# EasyEDA schematic SCH_FMPAC-5V-NEW_2023-12-27.json

## Sheets
1 OPLL-5V: TITLE: Sheet_1; REV: 1.0; Date: 2023-12-27; Sheet: 1/1; Drawn By: Denjhang; Company: Your Company
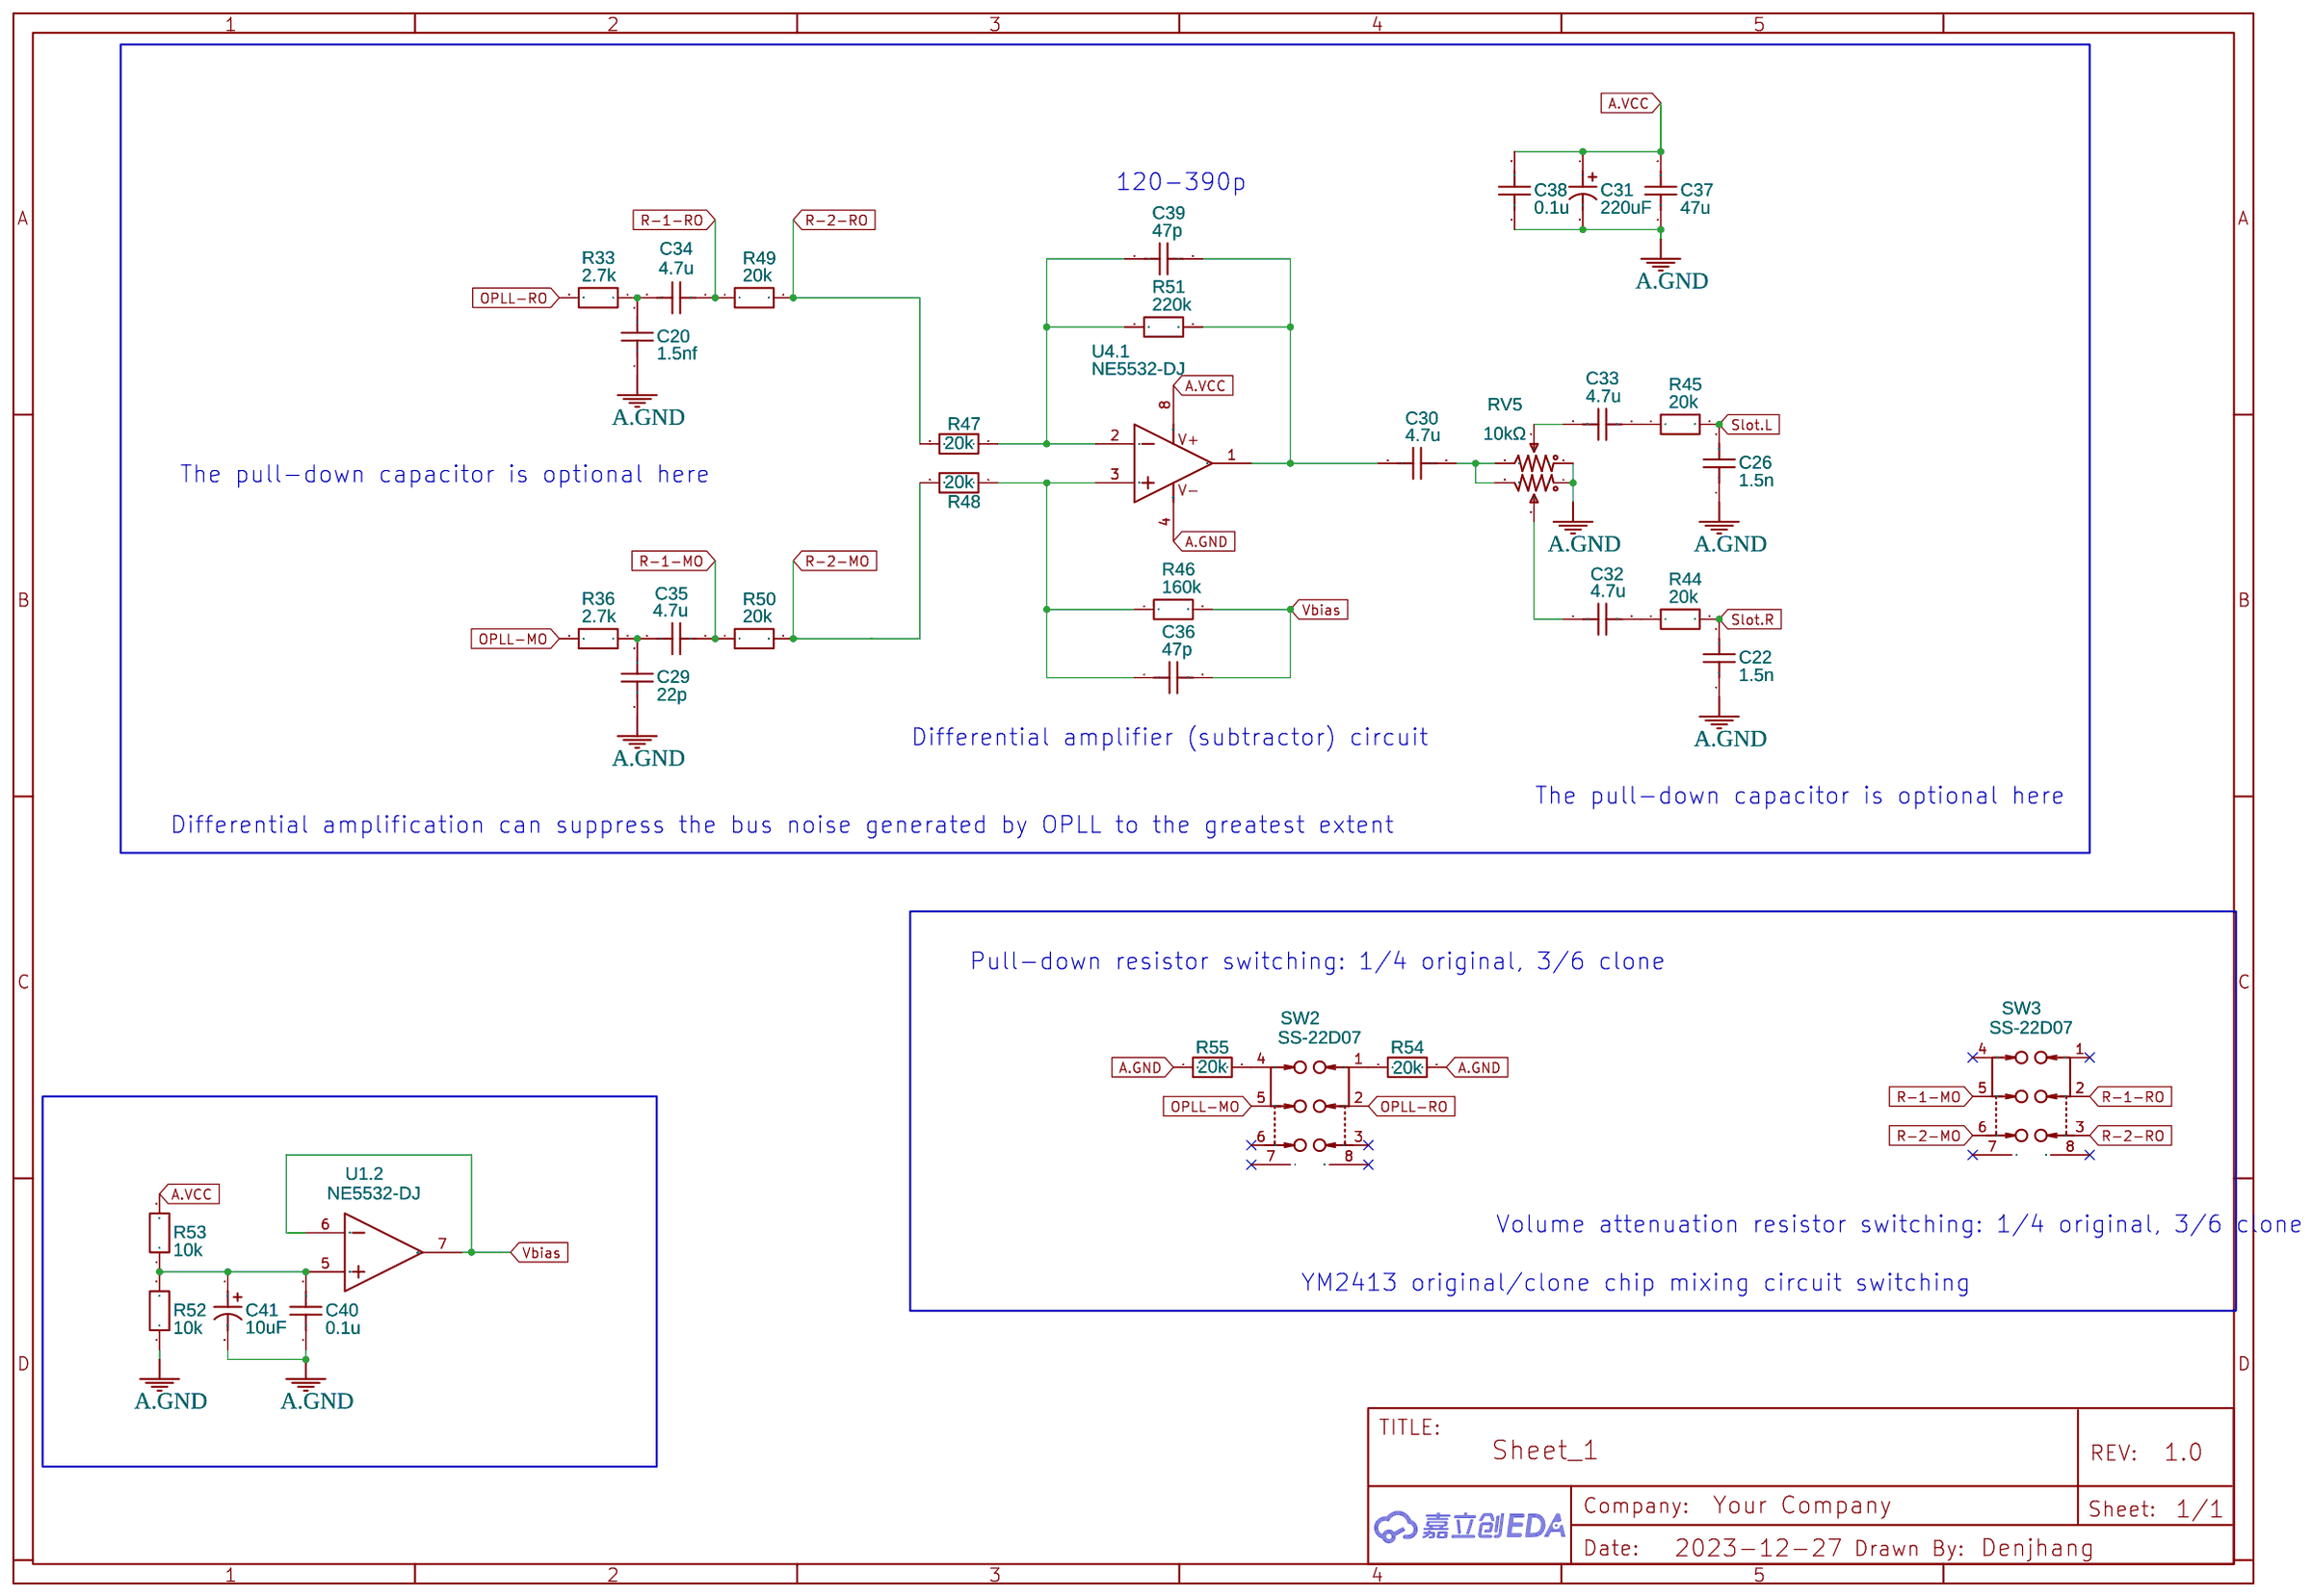
[diagram p0: OPLL-5V]
2 PSG
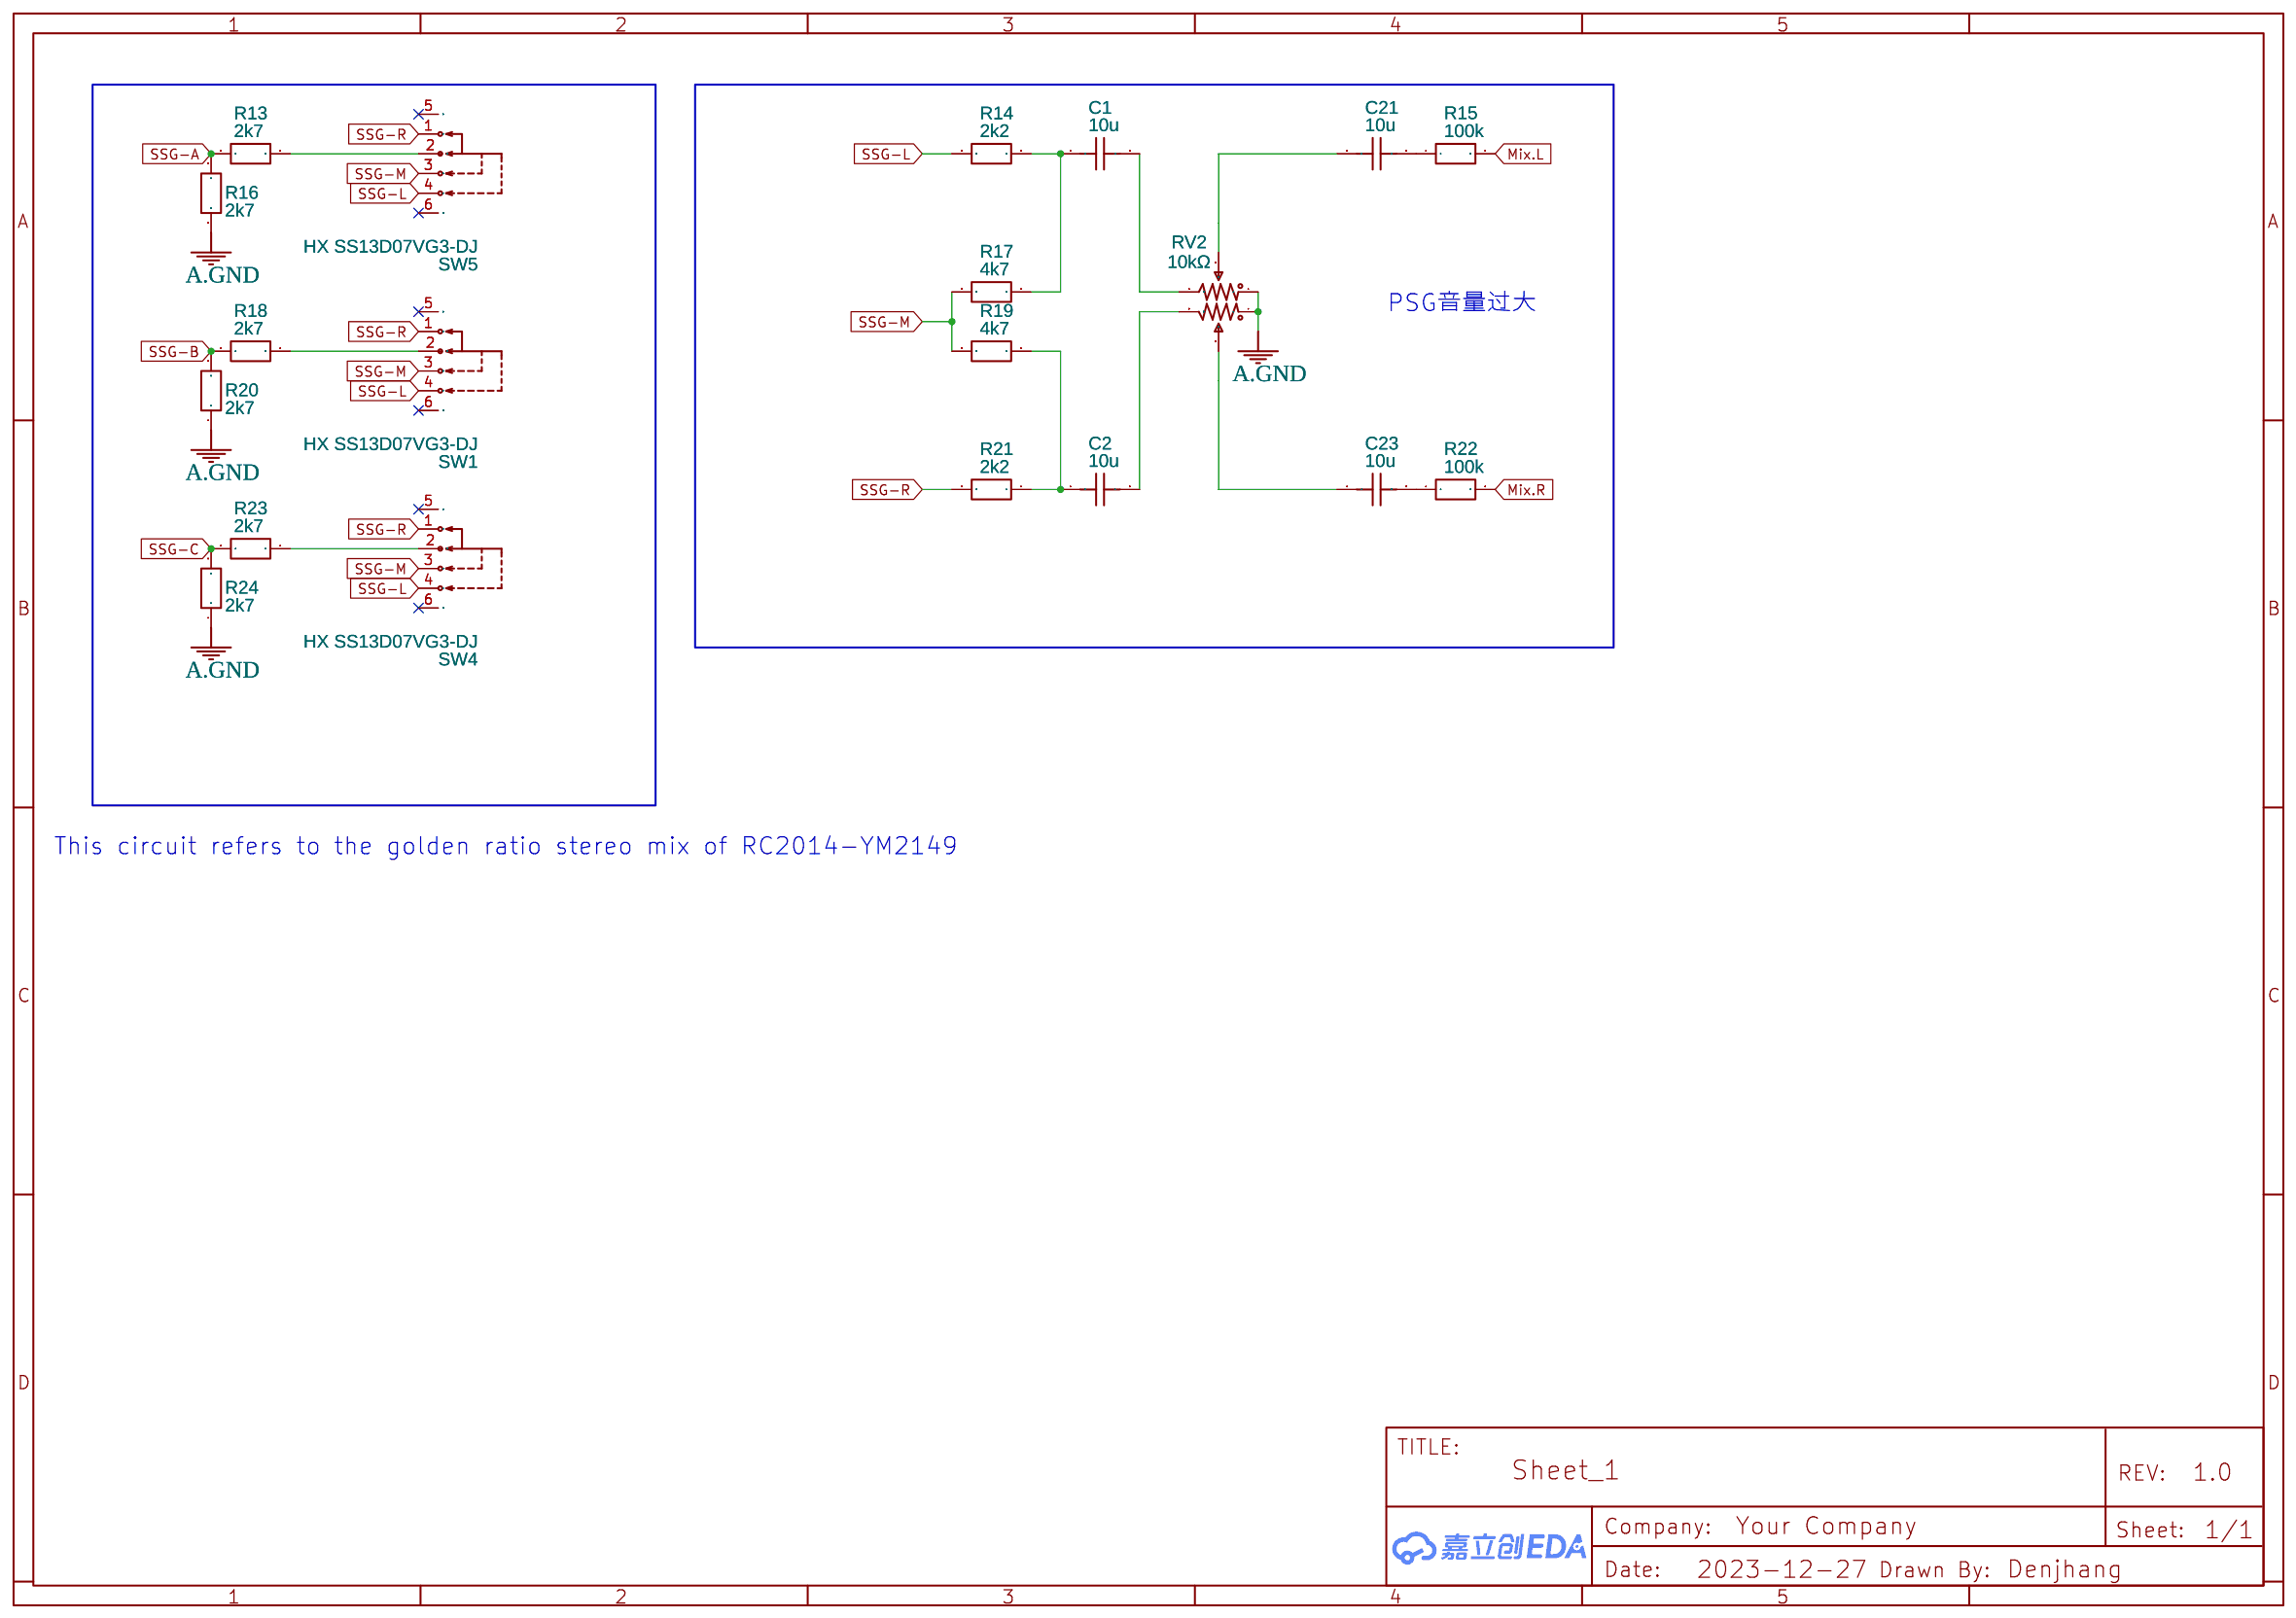
[diagram p1: PSG]
3 Mixer
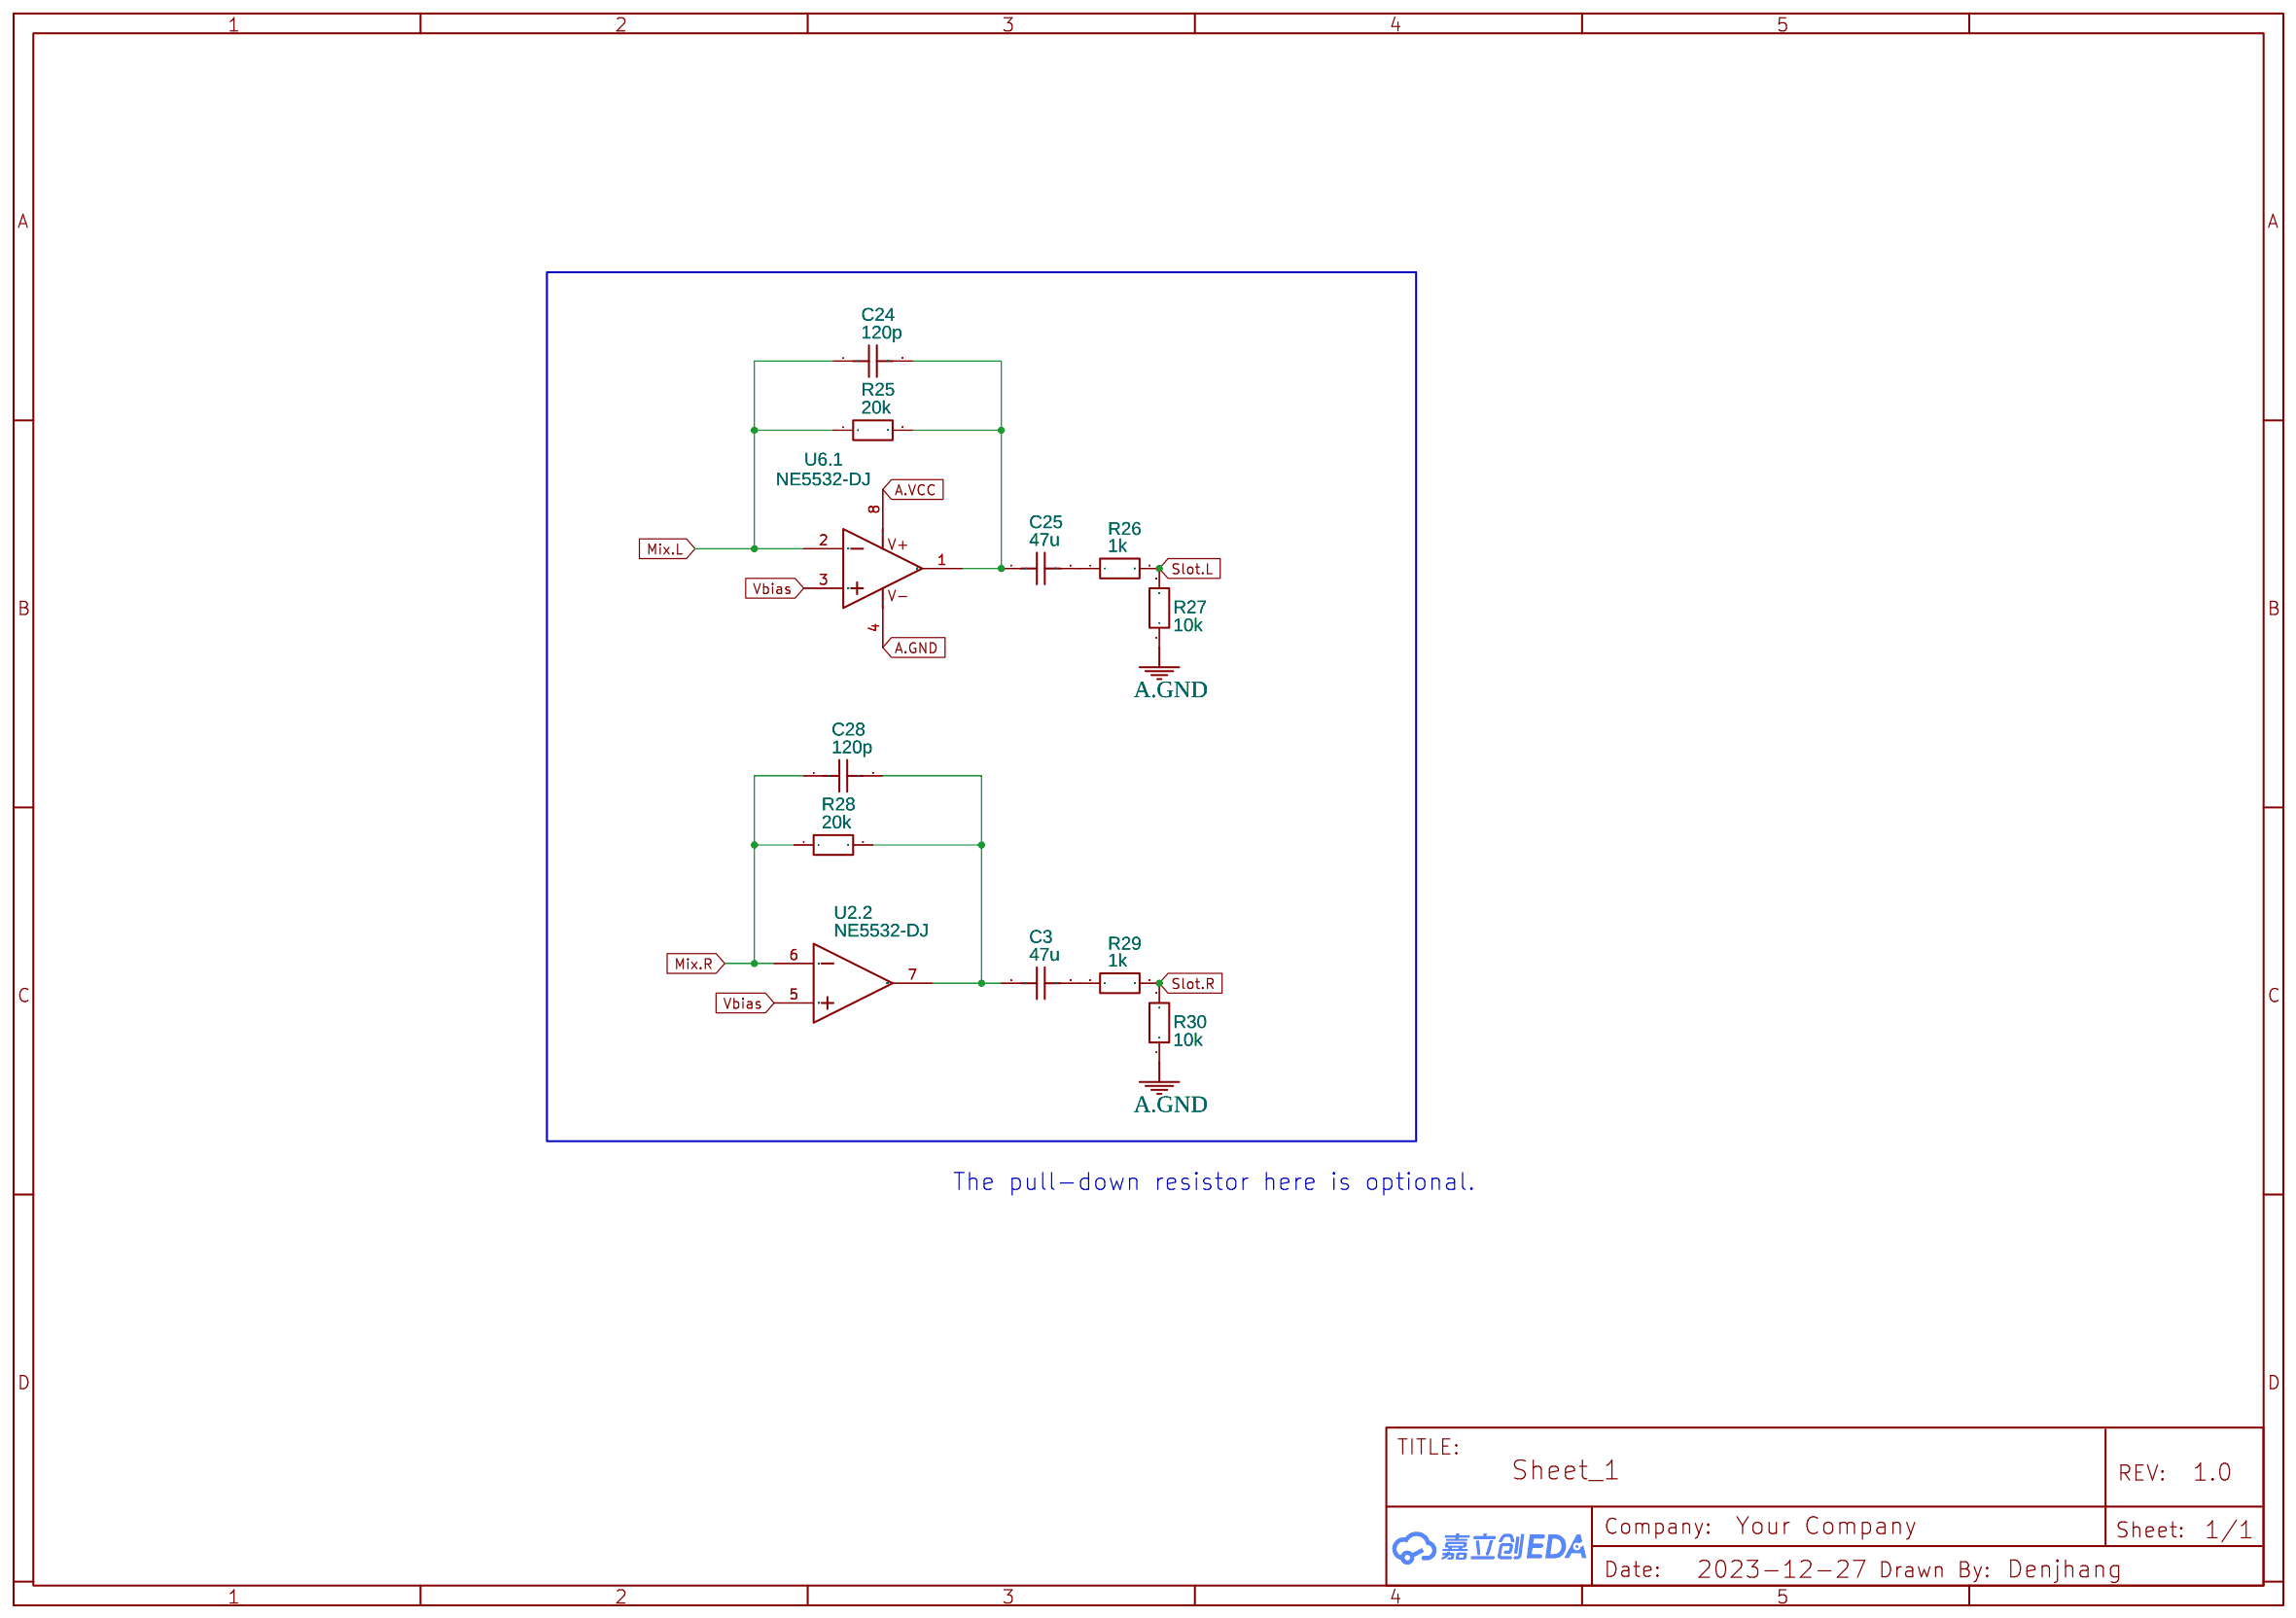
[diagram p2: Mixer]

## Parts
sheet Mixer
C3  47u  [C0805]
C24  120p  [C0603]
C25  47u  [C0805]
C28  120p  [C0603]
R25  20k  [R0603]
R26  1k  [R0603]
R27  10k  [R0603]
R28  20k  [R0603]
R29  1k  [R0603]
R30  10k  [R0603]
U2  NE5532-DJ  [DIP-8-DJ]  (section 2)
U6  NE5532-DJ  [DIP-8-DJ]  (section 1)
sheet OPLL-5V
C20  1.5nf  [C0603]
C22  1.5n  [C0603]
C26  1.5n  [C0603]
C29  22p  [C0603]
C30  4.7u  [C0603]
C31  220uF  [CAP-SMD_BD6.3-L6.6-W6.6-LS7.2-FD]
C32  4.7u  [C0603]
C33  4.7u  [C0603]
C34  4.7u  [C0603]
C35  4.7u  [C0603]
C36  47p  [C0603]
C37  47u  [C0805]
C38  0.1u  [C0603]
C39  47p  [C0603]
C40  0.1u  [C0603]
C41  10uF  [CAP-SMD_BD5.0-L5.3-W5.3-LS6.0-FD]
R33  2.7k  [R0603]
R36  2.7k  [R0603]
R44  20k  [R0603]
R45  20k  [R0603]
R46  160k  [R0603]
R47  20k  [R0603]
R48  20k  [R0603]
R49  20k  [R0603]
R50  20k  [R0603]
R51  220k  [R0603]
R52  10k  [R0603]
R53  10k  [R0603]
R54  20k  [R0603]
R55  20k  [R0603]
RV5  10kΩ  [RK097G-DJ]
SW2  SS-22D07  [SW-TH_SS-22D07]
SW3  SS-22D07  [SW-TH_SS-22D07]
U1  NE5532-DJ  [DIP-8-DJ]  (section 2)
U4  NE5532-DJ  [DIP-8-DJ]  (section 1)
sheet PSG
C1  10u  [C0603]
C2  10u  [C0603]
C21  10u  [C0603]
C23  10u  [C0603]
R13  2k7  [R0603]
R14  2k2  [R0603]
R15  100k  [R0603]
R16  2k7  [R0603]
R17  4k7  [R0603]
R18  2k7  [R0603]
R19  4k7  [R0603]
R20  2k7  [R0603]
R21  2k2  [R0603]
R22  100k  [R0603]
R23  2k7  [R0603]
R24  2k7  [R0603]
RV2  10kΩ  [RK097G-DJ]
SW1  HX SS13D07VG3-DJ  [SW-TH_SS13D07VG4]
SW4  HX SS13D07VG3-DJ  [SW-TH_SS13D07VG4]
SW5  HX SS13D07VG3-DJ  [SW-TH_SS13D07VG4]

## Library data of the parts
C3 C25 C37 = C_0805_US: Contributor: LCEDA_Lib
C1 C2 C20-C24 C26 C28-C30 C32-C36 C38-C40 = C_0603_US: Contributor: LCEDA_Lib
R13-R30 R33 R36 R44-R55 = R_0603_EU: Contributor: LCEDA_Lib
U1 U2 U4 U6 = NE5532-DJ: tags: Audio Operational Amplifier; Supplier Part: C5326; Supplier: LCSC; Manufacturer: TI; Manufacturer Part: NE5532P; subpart_no: 1; image: http://image.lceda.cn/szlcsc/C5326.jpg; JLCPCB Part Class: Extended Part; Contributor: Denjhang
C31 = RVT47UF35V67RV0039: Contributor: LCSC; Supplier: LCSC; Supplier Part: C2836440; Manufacturer: KNSCHA(科尼盛); JLCPCB Part Class: Extended Part; link: https://so.szlcsc.com/global.html?k=C2836440&ref=editor
C41 = RVT100UF10V67RV0036: Contributor: LCSC; Supplier: LCSC; Supplier Part: C2891567; Manufacturer: KNSCHA(科尼盛); JLCPCB Part Class: Extended Part; link: https://so.szlcsc.com/global.html?k=C2891567&ref=editor
RV2 RV5 = RK097-双连体: Contributor: LCSC; Supplier: LCSC; Supplier Part: C231763; Manufacturer: ALPSALPINE(阿尔卑斯阿尔派); Manufacturer Part: RK09712200MY; JLCPCB Part Class: Extended Part
SW2 SW3 = SS-22D07: Supplier Part: C34982; Supplier: LCSC; Manufacturer: ReliaPro; JLCPCB Part Class: Extended Part; link: https://so.szlcsc.com/global.html?k=C34982&ref=editor
SW1 SW4 SW5 = HX SS13D07VG3-DJ: Supplier: LCSC; Supplier Part: C5149830; Manufacturer: hanxia(韩下); Manufacturer Part: HX SS13D07VG3; link: https://atta.szlcsc.com/upload/public/pdf/source/20220907/D3055C4464BFAA66BEB4549CABC5DD1D.pdf; Contributor: Denjhang

## Nets
A.GND: C20.1 C22.1 C26.1 C29.1 C31.2 C37.1 C38.1 C40.1 C41.2 R16.1 R20.1 R24.1 R27.1 R30.1 R52.1 R54.2 R55.1 RV2.1 RV2.4 RV5.1 RV5.4 U4.4(VCC-) U6.4(VCC-)
A.VCC: C31.1 C37.2 C38.2 R53.2 U4.8(VCC+) U6.8(VCC+)
Mix.L: C24.1 R15.2 R25.1 U6.2(IN1-)
Mix.R: C28.1 R22.2 R28.1 U2.6(IN2-)
OPLL-MO: R36.2 SW2.5
OPLL-RO: R33.2 SW2.2
R-1-MO: C35.1 R50.1 SW3.5
R-1-RO: C34.1 R49.1 SW3.2
R-2-MO: R48.2 R50.2 SW3.6
R-2-RO: R47.2 R49.2 SW3.3
Slot.L: C26.2 R26.2 R27.2 R45.2
Slot.R: C22.2 R29.2 R30.2 R44.2
SSG-A: R13.2 R16.2
SSG-B: R18.2 R20.2
SSG-C: R23.2 R24.2
SSG-L: R14.2 SW1.4 SW4.4 SW5.4
SSG-M: R17.2 R19.2 SW1.3 SW4.3 SW5.3
SSG-R: R21.2 SW1.1 SW4.1 SW5.1
Vbias: C36.2 R46.2 U1.6(IN2-) U1.7(OUT2) U2.5(IN2+) U6.3(IN1+)
Net-(C1-1): C1.1 R14.1 R17.1
Net-(C1-2): C1.2 RV2.3
Net-(C2-1): C2.1 R19.1 R21.1
Net-(C2-2): C2.2 RV2.6
Net-(C3-1): C3.1 C28.2 R28.2 U2.7(OUT2)
Net-(C3-2): C3.2 R29.1
Net-(C20-2): C20.2 C34.2 R33.1
Net-(C21-1): C21.1 RV2.2
Net-(C21-2): C21.2 R15.1
Net-(C23-1): C23.1 RV2.5
Net-(C23-2): C23.2 R22.1
Net-(C24-2): C24.2 C25.1 R25.2 U6.1(OUT1)
Net-(C25-2): C25.2 R26.1
Net-(C29-2): C29.2 C35.2 R36.1
Net-(C30-1): C30.1 C39.2 R51.2 U4.1(OUT1)
Net-(C30-2): C30.2 RV5.3 RV5.6
Net-(C32-1): C32.1 RV5.5
Net-(C32-2): C32.2 R44.1
Net-(C33-1): C33.1 R45.1
Net-(C33-2): C33.2 RV5.2
Net-(C36-1): C36.1 R46.1 R48.1 U4.3(IN1+)
Net-(C39-1): C39.1 R47.1 R51.1 U4.2(IN1-)
Net-(C40-2): C40.2 C41.1 R52.2 R53.1 U1.5(IN2+)
Net-(R13-1): R13.1 SW5.2
Net-(R18-1): R18.1 SW1.2
Net-(R23-1): R23.1 SW4.2
Net-(R54-1): R54.1 SW2.1
Net-(R55-2): R55.2 SW2.4

Not connected (* = marked no-connect by the designer): SW1 5* 6*; SW2 3* 6* 7* 8*; SW3 1* 4* 7* 8*; SW4 5* 6*; SW5 5* 6*

## Notes on the sheets
sheet 1
- 120-390p
- The pull-down capacitor is optional here
- Differential amplifier (subtractor) circuit
- The pull-down capacitor is optional here
- Differential amplification can suppress the bus noise generated by OPLL to the greatest extent
- Pull-down resistor switching: 1/4 original, 3/6 clone
- Volume attenuation resistor switching: 1/4 original, 3/6 clone
- YM2413 original/clone chip mixing circuit switching
sheet 2
- PSG音量过大
- This circuit refers to the golden ratio stereo mix of RC2014-YM2149
sheet 3
- The pull-down resistor here is optional.
